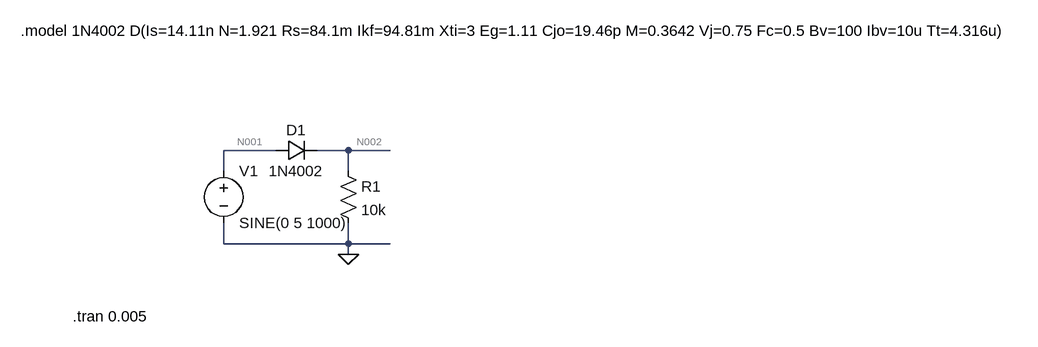
[diagram p0: schematic HalfWaveRectifier.asc]
HalfWaveRectifier.asc, the LTspice schematic file:
Version 4.1
SHEET 1 1496 680
WIRE 192 80 112 80
WIRE 304 80 256 80
WIRE 368 80 304 80
WIRE 112 112 112 80
WIRE 304 112 304 80
WIRE 112 224 112 192
WIRE 304 224 304 192
WIRE 304 224 112 224
WIRE 368 224 304 224
WIRE 304 240 304 224
FLAG 304 240 0
SYMBOL voltage 112 96 R0
WINDOW 123 0 0 Left 0
WINDOW 39 0 0 Left 0
SYMATTR InstName V1
SYMATTR Value SINE(0 5 1000)
SYMBOL diode 192 96 R270
WINDOW 0 32 32 VTop 2
WINDOW 3 0 32 VBottom 2
SYMATTR InstName D1
SYMATTR Value 1N4002
SYMBOL res 288 96 R0
SYMATTR InstName R1
SYMATTR Value 10k
TEXT -200 -104 Left 2 !.model 1N4002 D(Is=14.11n N=1.921 Rs=84.1m Ikf=94.81m Xti=3 Eg=1.11 Cjo=19.46p M=0.3642 Vj=0.75 Fc=0.5 Bv=100 Ibv=10u Tt=4.316u)
TEXT -120 336 Left 2 !.tran 0.005

The netlist it stands for:
* HalfWaveRectifier.asc
V1 N001 0 SINE(0 5 1000)
D1 N001 N002 1N4002
R1 N002 0 10k
.model D D
.lib standard.dio
.model 1N4002 D(Is=14.11n N=1.921 Rs=84.1m Ikf=94.81m Xti=3 Eg=1.11 Cjo=19.46p M=0.3642 Vj=0.75 Fc=0.5 Bv=100 Ibv=10u Tt=4.316u)
.tran 0.005
.backanno
.end

* Results of the author's LTspice run, read from the files saved beside the schematic
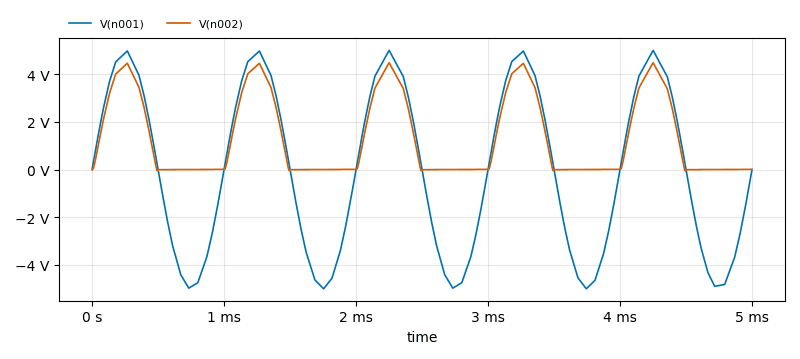
[diagram p1: Transient Analysis of HalfWaveRectifier.asc, plotted from the saved traces]
* Transient Analysis, 1 run:
*   V(n001): min -4.998 V, max 4.994 V, average -13.35 mV, rms 3.49 V, last 0 V
*   V(n002): min -53.65 mV, max 4.479 V, average 1.327 V, rms 2.142 V, last 6.244 mV